# EAGLE design uBraids_SE_Display_Module (EAGLE 9.5.2)
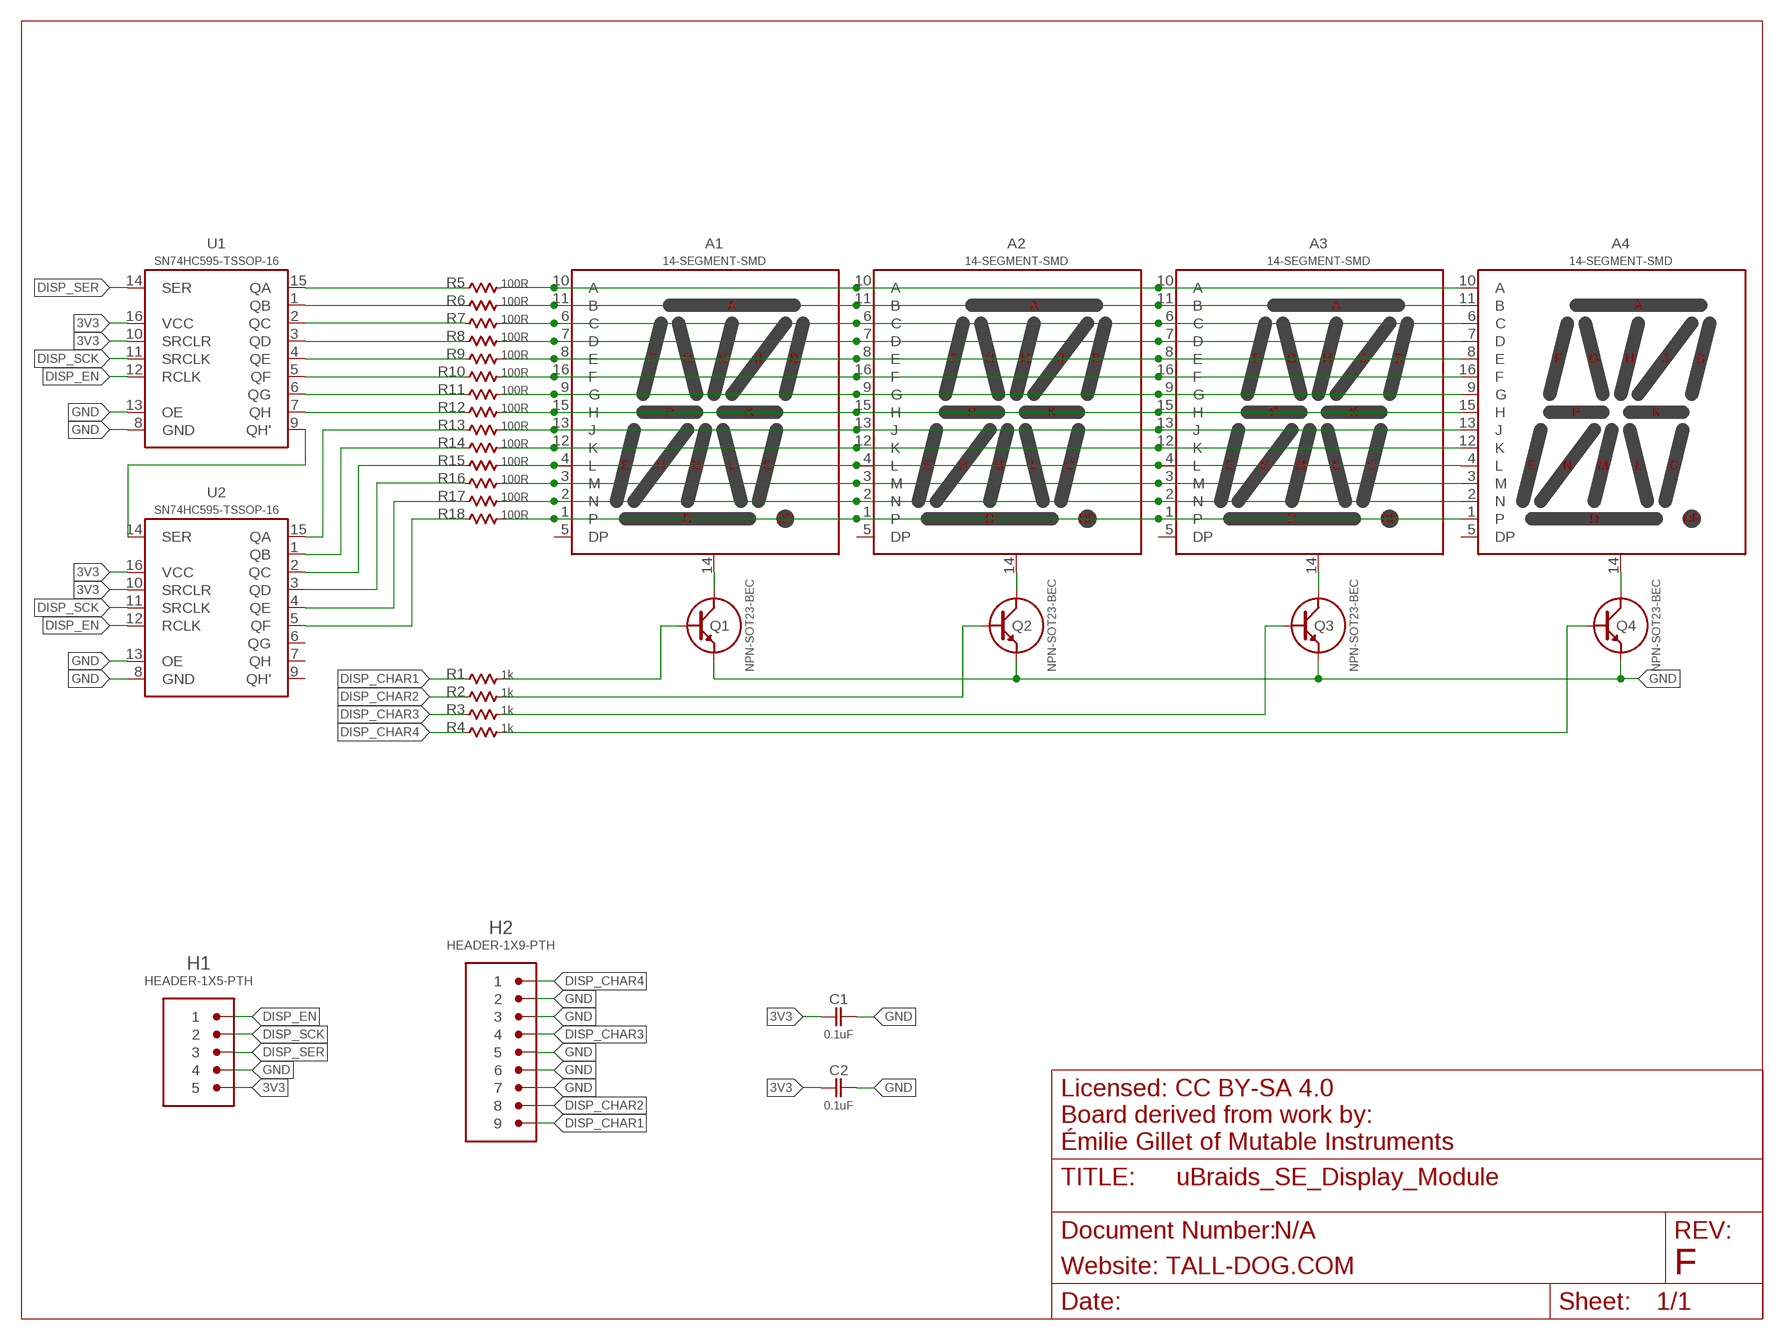
[diagram p0: schematic, sheet 1]

## Parts
A1  14-SEGMENT-SMD  [14-SEGMENT]
A2  14-SEGMENT-SMD  [14-SEGMENT]
A3  14-SEGMENT-SMD  [14-SEGMENT]
A4  14-SEGMENT-SMD  [14-SEGMENT]
C1  0.1uF  CAP-NP-0603  [0603-NP]
C2  0.1uF  CAP-NP-0603  [0603-NP]
H1  HEADER-1X5-PTH  [PTH-0.1-1X5]
H2  HEADER-1X9-PTH  [PTH-0.1-1X9]
Q1  NPN-SOT23-BEC  [SOT-23]
Q2  NPN-SOT23-BEC  [SOT-23]
Q3  NPN-SOT23-BEC  [SOT-23]
Q4  NPN-SOT23-BEC  [SOT-23]
R1  1k  RESISTOR-0603  [0603-NP]
R2  1k  RESISTOR-0603  [0603-NP]
R3  1k  RESISTOR-0603  [0603-NP]
R4  1k  RESISTOR-0603  [0603-NP]
R5  100R  RESISTOR-0603  [0603-NP]
R6  100R  RESISTOR-0603  [0603-NP]
R7  100R  RESISTOR-0603  [0603-NP]
R8  100R  RESISTOR-0603  [0603-NP]
R9  100R  RESISTOR-0603  [0603-NP]
R10  100R  RESISTOR-0603  [0603-NP]
R11  100R  RESISTOR-0603  [0603-NP]
R12  100R  RESISTOR-0603  [0603-NP]
R13  100R  RESISTOR-0603  [0603-NP]
R14  100R  RESISTOR-0603  [0603-NP]
R15  100R  RESISTOR-0603  [0603-NP]
R16  100R  RESISTOR-0603  [0603-NP]
R17  100R  RESISTOR-0603  [0603-NP]
R18  100R  RESISTOR-0603  [0603-NP]
U1  SN74HC595-TSSOP-16  [TSSOP-16]
U2  SN74HC595-TSSOP-16  [TSSOP-16]

## Nets
3V3: C1.1 C2.1 H1.5 U1.10(SRCLR) U1.16(VCC) U2.10(SRCLR) U2.16(VCC)
A: A1.10(A) A2.10(A) A3.10(A) A4.10(A) R5.2
A1C: A1.14(CATHODE) Q1.3(C)
A2C: A2.14(CATHODE) Q2.3(C)
A3C: A3.14(CATHODE) Q3.3(C)
A4C: A4.14(CATHODE) Q4.3(C)
B: A1.11(B) A2.11(B) A3.11(B) A4.11(B) R6.2
C: A1.6(C) A2.6(C) A3.6(C) A4.6(C) R7.2
D: A1.7(D) A2.7(D) A3.7(D) A4.7(D) R8.2
DISP_CHAR1: H2.9 R1.1
DISP_CHAR2: H2.8 R2.1
DISP_CHAR3: H2.4 R3.1
DISP_CHAR4: H2.1 R4.1
DISP_EN: H1.1 U1.12(RCLK) U2.12(RCLK)
DISP_SCK: H1.2 U1.11(SRCLK) U2.11(SRCLK)
DISP_SER: H1.3 U1.14(SER)
E: A1.8(E) A2.8(E) A3.8(E) A4.8(E) R9.2
F: A1.16(F) A2.16(F) A3.16(F) A4.16(F) R10.2
G: A1.9(G) A2.9(G) A3.9(G) A4.9(G) R11.2
GND: C1.2 C2.2 H1.4 H2.2 H2.3 H2.5 H2.6 H2.7 Q1.2(E) Q2.2(E) Q3.2(E) Q4.2(E) U1.8(GND) U1.13(OE) U2.8(GND) U2.13(OE)
H: A1.15(H) A2.15(H) A3.15(H) A4.15(H) R12.2
J: A1.13(J) A2.13(J) A3.13(J) A4.13(J) R13.2
K: A1.12(K) A2.12(K) A3.12(K) A4.12(K) R14.2
L: A1.4(L) A2.4(L) A3.4(L) A4.4(L) R15.2
M: A1.3(M) A2.3(M) A3.3(M) A4.3(M) R16.2
N: A1.2(N) A2.2(N) A3.2(N) A4.2(N) R17.2
P: A1.1(P) A2.1(P) A3.1(P) A4.1(P) R18.2
Q1B: Q1.1(B) R1.2
Q2B: Q2.1(B) R2.2
Q3B: Q3.1(B) R3.2
Q4B: Q4.1(B) R4.2
RA: R5.1 U1.15(QA)
RB: R6.1 U1.1(QB)
RC: R7.1 U1.2(QC)
RD: R8.1 U1.3(QD)
RE: R9.1 U1.4(QE)
RF: R10.1 U1.5(QF)
RG: R11.1 U1.6(QG)
RH: R12.1 U1.7(QH)
RJ: R13.1 U2.15(QA)
RK: R14.1 U2.1(QB)
RL: R15.1 U2.2(QC)
RM: R16.1 U2.3(QD)
RN: R17.1 U2.4(QE)
RP: R18.1 U2.5(QF)
U1-U2: U1.9(QH') U2.14(SER)
Unconnected: A1.5(DP) A2.5(DP) A3.5(DP) A4.5(DP) U2.6(QG) U2.7(QH) U2.9(QH')

## Notes on the sheet
- Licensed: CC BY-SA 4.0
  Board derived from work by:
  Émilie Gillet of Mutable Instruments
- N/A
- Website: TALL-DOG.COM | F

## Library data of the parts
A1-A4 = uBraids_SE_Library:14-SEGMENT
C1 C2 = uBraids_SE_Library:CAP-NP
H1 = uBraids_SE_Library:HEADER-1X5
H2 = uBraids_SE_Library:HEADER-1X9
Q1-Q4 = uBraids_SE_Library:NPN
R1-R18 = uBraids_SE_Library:RESISTOR
U1 U2 = uBraids_SE_Library:SN74HC595

## Board
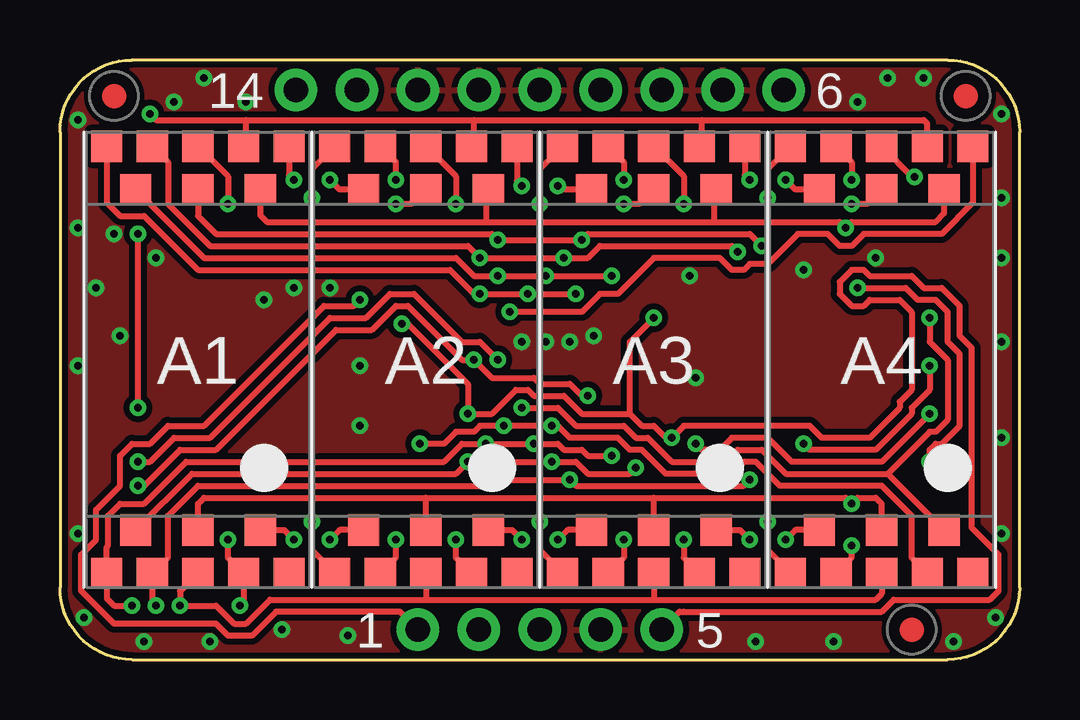
[diagram p1: board, top side]
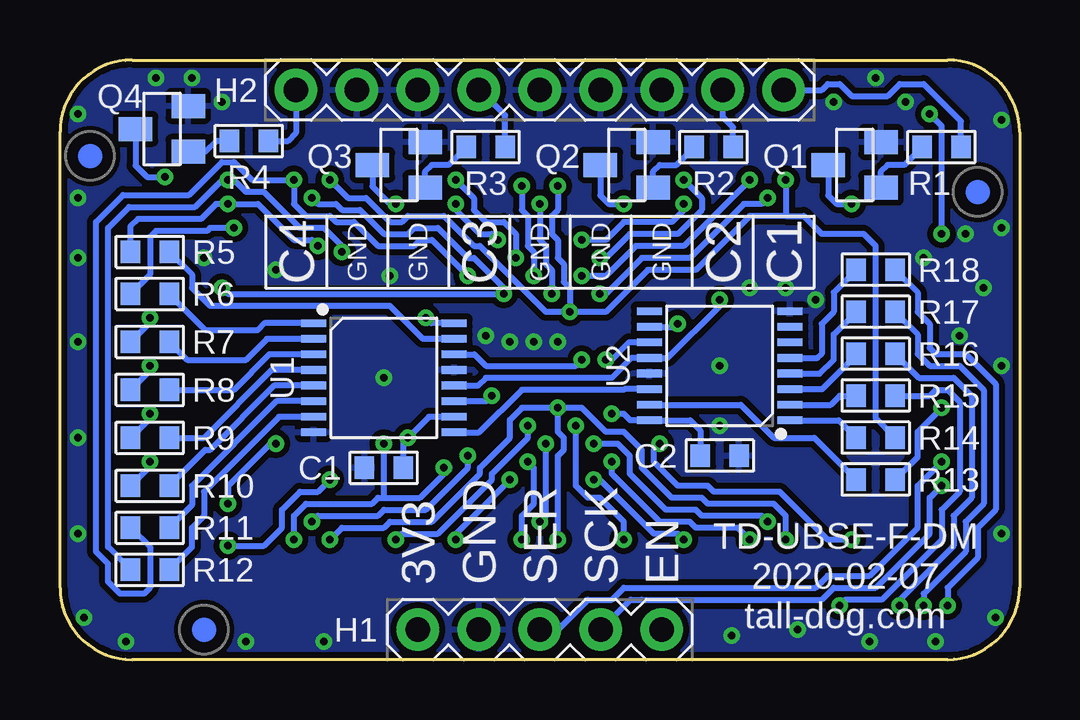
[diagram p2: board, bottom side, seen from below]

Size 40 x 25 mm. Coordinates in mm from the lower left corner, seen from the top.
Outline: 3,0 37,0 arc90 40,3 40,22 arc90 37,25 3,25 arc90 0,22 0,3 arc90 3,0
Copper layers (1*16): Top 0.035mm / dielectric 1.5mm / Bottom 0.035mm
Design rules "default *": minimum track width 9mil, minimum drill 13mil, track to track 8mil, track to pad 8mil, pad to pad 8mil, via to via 8mil, smd to smd 0mil, copper to edge 8mil, drill to drill 10mil, minimum pad ring 7mil, minimum via ring 7mil, stop-mask expansion 2mil, vias tented up to drill 13mil, thermal gap 0.25mm

### Footprints (pad centres in the part's own frame; a part is rotated, then mirrored left to right if it is on the bottom)
14-SEGMENT = smd 1.3 x 1.3: 1 -3.8,-8.9; 2 -1.9,-8.9; 3 0,-8.9; 4 1.9,-8.9; 5 3.8,-8.9; 6 2.6,-7.1; 7 0,-7.1; 8 -2.6,-7.1; 9 -2.6,7.1; 10 0,7.1; 11 2.6,7.1; 12 3.8,8.9; 13 1.9,8.9; 14 0,8.9; 15 -1.9,8.9; 16 -3.8,8.9
0603-NP = smd 0.81 x 0.93: 1 -0.81,0; 2 0.81,0
PTH-0.1-1X5 = drill 1.016 pad 1.778: 1 -5.08,0; 2 -2.54,0; 3 0,0; 4 2.54,0; 5 5.08,0
PTH-0.1-1X9 = drill 1.016 pad 1.778: 1 -10.16,0; 2 -7.62,0; 3 -5.08,0; 4 -2.54,0; 5 0,0; 6 2.54,0; 7 5.08,0; 8 7.62,0; 9 10.16,0
SOT-23 = smd 1 x 1.4: 1 -0.95,-1.1; 2 0.95,-1.1; 3 0,1.1
TSSOP-16 = smd 0.32 x 1.05: 1 -2.275,-2.925; 2 -1.625,-2.925; 3 -0.975,-2.925; 4 -0.325,-2.925; 5 0.325,-2.925; 6 0.975,-2.925; 7 1.625,-2.925; 8 2.275,-2.925; 9 2.275,2.925; 10 1.625,2.925; 11 0.975,2.925; 12 0.325,2.925; 13 -0.325,2.925; 14 -0.975,2.925; 15 -1.625,2.925; 16 -2.275,2.925

### Placement (x,y rotation side)
A1  5.75,12.5 0 top
A2  15.25,12.5 0 top
A3  24.75,12.5 0 top
A4  34.25,12.5 0 top
C1  26.5,8 180 bottom
C2  12.5,8.5 0 bottom
H1  20,1.25 180 bottom
H2  20,23.75 0 bottom
Q1  6.88,20.62 90 bottom
Q2  16.38,20.62 90 bottom
Q3  25.88,20.62 90 bottom
Q4  35.75,22.12 90 bottom
R1  3.25,21.38 180 bottom
R2  12.75,21.38 180 bottom
R3  22.25,21.38 180 bottom
R4  32.12,21.62 180 bottom
R5  36.25,17 180 bottom
R6  36.25,15.25 180 bottom
R7  36.25,13.25 180 bottom
R8  36.25,11.25 180 bottom
R9  36.25,9.25 180 bottom
R10  36.25,7.25 180 bottom
R11  36.25,5.5 180 bottom
R12  36.25,3.75 180 bottom
R13  6,7.5 0 bottom
R14  6,9.25 0 bottom
R15  6,11 0 bottom
R16  6,12.75 0 bottom
R17  6,14.5 0 bottom
R18  6,16.25 0 bottom
U1  26.5,11.75 270 bottom
U2  12.5,12.25 90 bottom
U$1  [FIDUCIAL]  37.75,23.5 0 top
U$2  [FIDUCIAL]  35.5,1.25 0 top
U$3  [FIDUCIAL]  2.25,23.5 0 top
U$4  [FIDUCIAL]  1.75,19.5 0 bottom
U$5  [FIDUCIAL]  38.75,21 0 bottom
U$6  [FIDUCIAL]  34,1.25 0 bottom

### Tracks (layer width: path | path; a pad name or v marks a point on that pad's centre or on a via)
3V3  (via drill 0.33 pad 0.69)
  Top 0.25: v14.25,14 14.5,14 17,11.5 v17,10.25 18,10.25 19,11.25 19.5,11.25 19.75,11 21,11 21.75,10.25 23.75,10.25 | 23.75,10.25 24.25,9.75 24.75,9.75 25.25,9.25 v25.5,9.25 26,9.75 31.25,9.75 31.75,9.25 33.75,9.25 35,10.5 35,10.75 35.5,11.25 35.5,14.5 35,15 33.75,15 33.5,14.75 33,14.75 32.5,15.25 32.5,15.75 33,16.25 33.5,16.25 33.75,16 35.5,16 36,15.5 36.75,15.5 37.5,14.75 37.5,13.5 38,13 38,5.5 39.12,4.38 39.12,2.88 38.75,2.5 34.75,2.5 34.25,2 26,2 25.83,2 H1.5 | 23.75,10.25 23.75,13.25 v24.75,14.25
  Bottom 0.25: U1.10 24.62,10.12 v25.5,9.25 25.69,9.06 C1.1 | C2.1 13.31,9.56 13.72,9.97 U2.16 16.23,9.97 16.5,10.25 v17,10.25 | U2.10 14.38,13.88 v14.25,14 | U1.16 24.52,14.03 v24.75,14.25
A  (via drill 0.33 pad 0.69)
  Top 0.25: v29.25,17.25 28.75,17.75 22,17.75 v21.75,17.5 v18.25,17.5 18,17.75 6.5,17.75 5.75,18.5 A1.10 | A3.10 24.15,19 v23.5,19 | A2.10 14.65,19 v14,19 | A4.10 33.65,19 v33,19
  Bottom 0.25: v23.5,19 23.5,18.75 22.5,17.75 22,17.75 v21.75,17.5 | v29.25,17.25 29.5,17.5 30.25,17.5 31.75,19 v33,19 33.25,19 33.5,19 34.12,18.38 36.75,18.38 37.06,18.07 R5.2 | v14,19 14,18.75 14.5,18.25 16.5,18.25 17.25,17.5 v18.25,17.5
A1C  (via drill 0.33 pad 0.69)
  Top 0.25: A1.14 7,20.15 v7,19
  Bottom 0.25: Q1.3 7.97,19.35 7.62,19 v7,19
A2C  (via drill 0.33 pad 0.69)
  Top 0.25: A2.14 16.5,20.15 v16.5,19
  Bottom 0.25: Q2.3 17.48,19.35 17.12,19 v16.5,19
A3C  (via drill 0.33 pad 0.69)
  Top 0.25: A3.14 26,20.15 v26,19
  Bottom 0.25: v26,19 26.25,19 26.98,19.73 Q3.3
A4C  (via drill 0.33 pad 0.69)
  Top 0.25: A4.14 35.52,20.12 v35.62,20.12
  Bottom 0.25: Q4.3 36.85,20.6 36.38,20.12 v35.62,20.12
B  (via drill 0.33 pad 0.69)
  Top 0.25: 17.75,18.25 8.62,18.25 8.35,18.52 A1.11 | 17.75,18.25 27.25,18.25 | 27.25,18.25 32.5,18.25 v32.75,18 33,18.25 36.5,18.25 36.85,18.6 A4.11 | A2.11 17.75,19.5 17.75,18.25 | A3.11 27.25,19.5 27.25,18.25
  Bottom 0.25: v32.75,18 33.75,18 33.88,17.88 36,17.88 36.25,17.62 36.25,16.06 R6.2
C  (via drill 0.33 pad 0.69)
  Top 0.25: v28.75,5 28.35,5.4 A3.6 | v19.25,10.5 20.75,10.5 21.5,9.75 23.5,9.75 24,9.25 24.5,9.25 25.5,8.25 27.75,8.25 28.25,8.75 29.25,8.75 30.25,7.75 34.5,7.75 | v36.25,14.25 36.25,13.25 37,12.5 37,10 36.5,9.5 36.25,9.5 34.5,7.75 | A1.6 9.35,5.4 v9.75,5 | A2.6 18.85,5.4 v19.25,5 | A4.6 34.5,7.75
  Bottom 0.25: v9.75,5 9.75,6 10.25,6.5 13,6.5 13.25,6.75 14.5,6.75 15.75,8 15.75,8.75 16.5,9.5 17.25,9.5 18.25,10.5 v19.25,10.5 | v19.25,5 19.25,8.5 19,8.75 19,9.25 19.25,9.5 v19.25,10.5 | v28.75,5 28.25,5.5 26.5,5.5 26.25,5.75 24.5,5.75 22.5,7.75 22.5,8 21.25,9.25 21.25,10 20.75,10.5 v19.25,10.5 | R7.2 36.25,14.06 v36.25,14.25
D  (via drill 0.33 pad 0.69)
  Top 0.25: 15.25,6.75 6,6.75 5.75,6.5 A1.7 | 15.25,6.75 24.75,6.75 | 24.75,6.75 32.75,6.75 v33,6.5 33.25,6.75 34,6.75 34.25,6.5 A4.7 | v36.25,12.25 36.25,11.25 35.5,10.5 35.5,10.25 34,8.75 31.25,8.75 v31,9 | A2.7 15.25,6.75 | A3.7 24.75,6.75
  Bottom 0.25: v31,9 31,9.25 33,7.25 v33,6.5 | R8.2 36.25,12.06 v36.25,12.25
DISP_CHAR1
  Bottom 0.25: R1.1 2.44,22.44 4,24 5,24 5.5,23.5 7,23.5 7.5,24 8,24 8.25,23.75 H2.9
DISP_CHAR2
  Bottom 0.25: R2.1 11.94,22.19 12.38,22.63 H2.8
DISP_CHAR3
  Bottom 0.25: R3.1 21.44,22.69 22.5,23.75 H2.4
DISP_CHAR4
  Bottom 0.25: R4.1 30.5,21.62 30.16,21.96 H2.1
DISP_EN  (via drill 0.33 pad 0.69)
  Top 0.25: v12.5,15 12.25,14.75 11,14.75 6,9.75 4.5,9.75 3.75,9 3,9 2.5,8.5 2.5,7.25 1.5,6.25 1.5,5 0.88,4.38 0.88,2.88 2.25,1.5 6.5,1.5 7,1 8,1 9,2 14,2 14.17,2 H1.1
  Bottom 0.25: U1.12 22.57,11.43 22.25,11.75 17,11.75 16.18,12.57 U2.12 14.68,12.57 12.5,14.75 v12.5,15
DISP_SCK  (via drill 0.33 pad 0.69)
  Top 0.25: v22,11 21.75,11 21.25,11.5 20,11.5 19.75,11.75 18,11.75 v17.25,12.5 16.75,12.5 14.5,14.75 14,14.75 13,13.75 11.5,13.75 6.5,8.75 5,8.75 3.5,7.25 v3.25,7.25
  Bottom 0.25: U2.11 16.27,13.22 17,12.5 v17.25,12.5 | v22,11 22.23,10.78 U1.11 | v3.25,7.25 3.75,6.75 3.75,5.25 6,3 7.75,3 8.25,2.5 15.75,2.5 16.21,2.5 H1.2
DISP_SER  (via drill 0.33 pad 0.69)
  Top 0.25: v3.25,8.25 3.75,8.25 4.75,9.25 6.25,9.25 11.25,14.25 12.75,14.25 13.75,15.25 14.75,15.25 16.75,13.25 17.5,13.25 v18.25,12.5
  Bottom 0.25: U1.14 22.73,12.72 22.25,12.25 18.5,12.25 v18.25,12.5 | v3.25,8.25 4.25,7.25 4.25,5.5 6.25,3.5 8,3.5 8.5,3 16.5,3 17,2.5 18,2.5 19.25,1.25 H1.3
E  (via drill 0.33 pad 0.69)
  Top 0.25: v24,8 23.75,7.75 22,7.75 21.5,8.25 v20.5,8.25 v17,8.25 16.5,7.75 5.5,7.75 A1.8 | v11.25,5 11.65,5.4 A2.8 | v20.75,5 21.15,5.4 A3.8 | v30.25,5 30.65,5.4 A4.8 | v36.25,10.25 34.25,8.25 30.5,8.25 29.5,9.25 28,9.25 27.5,8.75 26.75,8.75 v26.5,9
  Bottom 0.25: v11.25,5 11.75,5.5 13.5,5.5 13.75,5.75 15,5.75 17,7.75 v17,8.25 | v20.75,5 20.75,6 20.25,6.5 20.25,8 v20.5,8.25 | v30.25,5 30.25,6 29.75,6.5 27,6.5 26.75,6.75 26.5,6.75 | 26.5,6.75 25,6.75 23.75,8 v24,8 | 26.5,6.75 v26.5,9 | R9.2 36.25,10.06 v36.25,10.25
F  (via drill 0.33 pad 0.69)
  Top 0.25: v21.5,15.25 v19.5,15.25 v17.5,15.25 17.25,15.25 16.25,16.25 5.75,16.25 3.5,18.5 2.5,18.5 1.95,19.05 A1.16 | v36.25,8.25 36.25,8.75 36.5,9 36.75,9 37.5,9.75 37.5,12.75 37,13.25 37,14.5 36.5,15 35.75,15 35.25,15.5 v33.25,15.5 | A2.16 10.5,20.45 v10.5,19.25 | A3.16 20,20.45 v20,19 | A4.16 29.5,20.45 v29.5,19.25
  Bottom 0.25: v17.5,15.25 17.25,15.25 15.75,16.75 13.75,16.75 11.5,19 10.75,19 v10.5,19.25 | v20,19 20,17.5 19.75,17.25 19.75,16.5 19.5,16.25 v19.5,15.25 | v29.5,19.25 29.25,19 28.5,19 28.25,18.75 27.5,18.75 26.5,17.75 25.5,17.75 25.25,18 24.25,18 23,16.75 22.75,16.75 21.5,15.5 v21.5,15.25 33,15.25 v33.25,15.5 | R10.2 36.25,8.06 v36.25,8.25
G  (via drill 0.33 pad 0.69)
  Top 0.25: v23,16 v20.25,16 v18.25,16 17.25,16 16.5,16.75 6,16.75 A1.9 | v11.25,20 11.65,19.6 A2.9 | A3.9 20.9,19.6 v20.75,19.75 | A4.9 30.65,19.6 v30.25,20
  Bottom 0.25: v18.25,16 17.25,16 16,17.25 14,17.25 v11.25,20 | v20.75,19.75 20.75,18.75 20.5,18.5 20.5,17.25 20.25,17 v20.25,16 | v23,16 24.5,17.5 25,17.5 25.25,17.25 26.75,17.25 27.75,18.25 28.5,18.25 28.75,18.5 29.75,18.5 30.25,19 v30.25,20 32,20 32.75,20.75 33.25,20.75 34.62,19.38 37.38,19.38 38.5,18.25 38.5,4.5 38,4 38,3.25 37.5,2.75 36.5,2.75 36.25,3 36.25,4.69 R11.2
GND  (via drill 0.33 pad 0.69)
  other vias: 37.25,0.75 36,24.25 26.5,11.75 8.5,15 12.5,12.25 12.5,9.75 7.75,23.25 6,24.25 33.25,23.25 9.75,15.5 0.75,22.5 0.75,12.25 2.25,17.75 0.75,18 1,1.75 6.25,0.75 9.25,1.25 12,1 32.25,0.75 34.5,24.25 19.25,13.25 20.25,13.25 22.25,13.5 21.25,13.25 39,1.75 26.25,16 31,16.25 4,16.75 2.5,13.5 34,16.75 11.25,15.5 3.5,0.75 29,0.75 39.25,19.25 39.25,22.75 1.5,15.5 0.75,5.25 39.25,16.75 39.25,13.25 39.25,9.25 39.25,5.25 4.75,23.25
  pour Top (isolate 0.25): 0,25 40,25 40,0 0,0
  pour Bottom (isolate 0.25): 0,25 40,25 40,0 0,0
H  (via drill 0.33 pad 0.69)
  Top 0.25: v28.25,17 28,17.25 22.5,17.25 22,16.75 v21,16.75 v17.5,16.75 17,17.25 6.25,17.25 4.5,19 4.5,20.75 A1.15 | v14,20 14,20.75 A2.15 | A3.15 23.5,20.75 v23.5,20 | A4.15 33,20.75 v33,20
  Bottom 0.25: v14,20 13.25,19.25 13.25,18.75 14.25,17.75 16.25,17.75 17.25,16.75 v17.5,16.75 | v23.5,20 22.75,19.25 22.75,18.75 22.25,18.25 21.5,18.25 21,17.75 v21,16.75 | v28.25,17 28.25,17.25 29,18 30,18 31.5,19.5 32.25,19.5 32.75,20 v33,20 33.25,20 34.38,18.88 37.12,18.88 38,18 38,4.69 R12.2
J  (via drill 0.33 pad 0.69)
  Top 0.25: v3.75,22.75 4,22.5 7.75,22.5 | 7.75,22.5 17.25,22.5 | 17.25,22.5 26.75,22.5 | 26.75,22.5 36,22.5 36.15,22.35 A4.13 | v3.25,10.5 v3.25,17.75 | A1.13 7.75,21.5 7.75,22.5 | A2.13 17.25,21.5 17.25,22.5 | A3.13 26.75,21.5 26.75,22.5
  Bottom 0.25: v3.25,10.5 4.25,9.5 4.25,8.44 R13.2 | v3.25,17.75 3.25,22.25 v3.75,22.75
K  (via drill 0.33 pad 0.69)
  Top 0.25: v18.75,14.5 21.75,14.5 22.5,15.25 23.25,15.25 24.75,16.75 27.5,16.75 28,16.25 28.5,16.25 28.75,16.5 29.5,16.5 30.75,17.75 32,17.75 32.5,17.25 33,17.25 33.5,17.75 36.75,17.75 38.05,19.05 A4.12 | A1.12 9.55,20.2 v9.75,20 | A2.12 19.05,19.95 v19.25,19.75 | A3.12 28.55,20.2 v28.75,20
  Bottom 0.25: v9.75,20 9.75,18.5 | v18.75,14.5 17.25,14.5 15.5,16.25 13.5,16.25 11.25,18.5 9.75,18.5 | v19.25,19.75 19.25,18.75 19.5,18.5 19.5,17.75 19.25,17.5 19.25,16.75 19,16.5 19,15.75 18.75,15.5 v18.75,14.5 | v28.75,20 28,19.25 27.25,19.25 26.25,18.25 25.75,18.25 25.5,18.5 24,18.5 22.75,17.25 22.5,17.25 19.75,14.5 v18.75,14.5 | R14.2 6,10.06 6,17.25 6.5,17.75 8.25,17.75 9,18.5 9.75,18.5
L  (via drill 0.33 pad 0.69)
  Top 0.25: v26,5 26,4.25 A3.4 | v15,9 16,9 16.5,9.5 17.25,9.5 17.5,9.75 v18.5,9.75 v20.5,9.75 20.75,9.75 21.25,9.25 23.25,9.25 23.75,8.75 24.25,8.75 25.25,7.75 28,7.75 28.5,8.25 29,8.25 30,7.25 34.25,7.25 35.5,6 35.5,4.25 A4.4 | v7,5 7,4.25 A1.4 7.65,2.4 v7.5,2.25 | A2.4 16.5,4.25 v16.5,5
  Bottom 0.25: v26,5 25.75,5.25 24.25,5.25 22,7.5 22,7.75 20.5,9.25 v20.5,9.75 | v7,5 8,5 10,7 12.75,7 13,7.25 14.25,7.25 15.25,8.25 15.25,8.75 v15,9 | v16.5,5 16.5,5.75 17.5,6.75 18,6.75 18.5,7.25 v18.5,9.75 | R15.2 3.75,11 3.5,11.25 3,11.25 2.5,10.75 2.5,7 3.25,6.25 3.25,5 5.75,2.5 7.25,2.5 v7.5,2.25
M  (via drill 0.33 pad 0.69)
  Top 0.25: 15.25,2.5 8.75,2.5 7.75,1.5 7.25,1.5 6.5,2.25 v5,2.25 5,2.85 A1.3 | 15.25,2.5 24.75,2.5 | 24.75,2.5 34,2.5 34.25,2.75 A4.3 | A3.3 24.75,2.5 | A2.3 15.25,2.5
  Bottom 0.25: v5,2.25 5,2.5 2.75,4.75 2.75,6 2,6.75 2,11 2.75,11.75 4.19,11.75 R16.2
N  (via drill 0.33 pad 0.69)
  Top 0.25: v28.75,7.5 28.5,7.25 21.5,7.25 v21.25,7.5 v17.75,7.5 17.5,7.25 5.75,7.25 4.5,6 4.5,4.25 A1.2 3.85,2.4 v4,2.25 | v23.5,5 23.5,4.25 A3.2 | A2.2 14,4.25 v14,5 | A4.2 33,4.25 v33,4.75
  Bottom 0.25: v14,5 14.25,5.25 15.25,5.25 17.5,7.5 v17.75,7.5 | v23.5,5 23.5,5.25 v21.25,7.5 | v28.75,7.5 29.25,7 30,7 30.75,6.25 30.75,5.5 31.5,4.75 v33,4.75 | v4,2.25 4,2.75 2.25,4.5 2.25,5.75 1.5,6.5 1.5,11.25 2.5,12.25 3.75,12.25 4.25,12.75 4.25,13.56 R17.2
P  (via drill 0.33 pad 0.69)
  Top 0.25: v23,8.5 22,8.5 21.75,8.75 21,8.75 20.75,9 v19.75,9 v17.75,9 16.75,9 16,8.25 5.25,8.25 3.5,6.5 2.5,6.5 2,6 2,4.75 1.95,4.7 A1.1 1.95,2.55 2.25,2.25 v3,2.25 | v10.5,5.75 10.5,4.55 A2.1 | v20,5.75 20,4.55 A3.1 | v29.5,5.75 29.5,4.55 A4.1
  Bottom 0.25: v10.5,5.75 10.75,6 13.25,6 13.5,6.25 14.75,6.25 16.25,7.75 16.25,8.5 16.75,9 v17.75,9 | v20,5.75 19.75,6 v19.75,9 | v29.5,5.75 29.25,6 26.75,6 26.5,6.25 24.75,6.25 23,8 v23,8.5 | v3,2.25 3,3 1.75,4.25 1.75,5.5 1,6.25 1,11.5 2.25,12.75 3.5,12.75 3.75,13 3.75,14 4.25,14.5 4.25,15.31 R18.2
Q1B
  Bottom 0.25: R1.2 4.81,20.62 5.5,20.62 5.78,20.35 Q1.1
Q2B
  Bottom 0.25: R2.2 14.31,20.62 15,20.62 15.28,20.35 Q2.1
Q3B
  Bottom 0.25: R3.2 23.81,20.62 24.5,20.62 24.77,20.35 Q3.1
Q4B
  Bottom 0.25: Q4.1 33.95,21.18 33.5,21.62 R4.2
RA
  Bottom 0.25: U1.15 24.88,13.38 26.25,14.75 33.75,14.75 34.5,15.5 34.5,16.06 R5.1
RB
  Bottom 0.25: R6.1 33.94,13.75 31.75,13.75 31.48,14.03 U1.1
RC
  Bottom 0.25: U1.2 31.38,13.38 32.25,12.5 34.69,12.5 R7.1
RD
  Bottom 0.25: R8.1 32.75,11.25 31.27,12.72 U1.3
RE
  Bottom 0.25: R9.1 34,9.25 31.18,12.07 U1.4
RF
  Bottom 0.25: U1.5 31.07,11.43 33.75,8.75 33.94,8.75 R10.1
RG
  Bottom 0.25: U1.6 30.98,10.78 34.5,7.25 34.5,6.44 R11.1
RH
  Bottom 0.25: U1.7 30.88,10.12 34,7 34,6 34.5,5.5 34.5,4.69 R12.1
RJ
  Bottom 0.25: U2.15 11.62,10.62 10.25,9.25 8.56,9.25 R13.1
RK
  Bottom 0.25: U2.1 7.54,9.97 R14.1
RL
  Bottom 0.25: R15.1 7.5,11 7.88,10.62 U2.2
RM
  Bottom 0.25: U2.3 8.22,11.28 6.81,12.69 R16.1
RN
  Bottom 0.25: U2.4 8.32,11.93 7.75,12.5 7.75,13.56 R17.1
RP
  Bottom 0.25: U2.5 8.43,12.57 8.25,12.75 8.25,14 7.75,14.5 7.75,15.31 R18.1
U1-U2
  Bottom 0.25: U1.9 22.52,9.47 20.75,11.25 16.5,11.25 16.48,11.28 U2.14

### Text on the board
tPlace: 14 | 6 | 1 | 5
bPlace: C1 | C2 | GND | GND | GND | C3 | GND | GND | C4 | TD-UBSE-F-DM / 2020-02-07 / tall-dog.com | EN | SCK | SER | GND | 3V3